# Altium schematic sheet ACCEL.SchDoc
size A3; DocumentNumber: 5; SheetNumber: 5; SheetTotal: 5
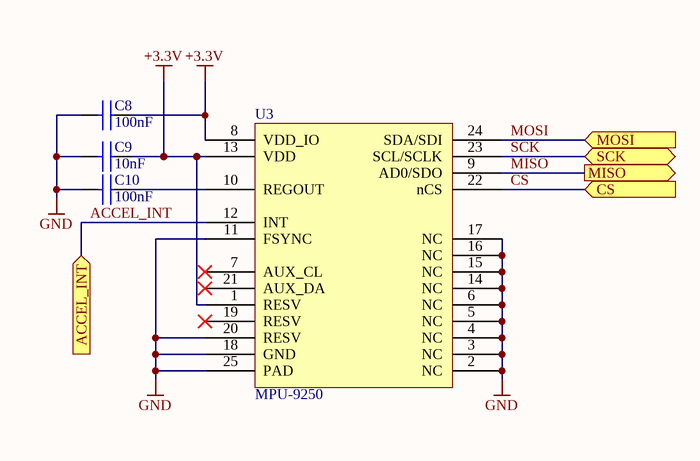
[diagram p0: ACCEL.SchDoc]

## Parts
C8  100nF  [CAP0603]
C9  10nF  [CAP0603]
C10  100nF  [CAP0603]
U3  MPU-9250  [QFN40P300X300X105_HS-25N]

## Ports
ACCEL_INT (in), CS (in), MISO (out), MOSI (in), SCK (bidir)

## Nets
+3.3V: C8.1 C9.1 U3.1(RESV) U3.8(VDD_IO) U3.13(VDD)
GND: C8.2 C9.2 C10.2 U3.2(NC) U3.3(NC) U3.4(NC) U3.5(NC) U3.6(NC) U3.11(FSYNC) U3.14(NC) U3.15(NC) U3.16(NC) U3.17(NC) U3.18(GND) U3.20(RESV) U3.25(PAD)
ACCEL_INT: U3.12(INT) ; port ACCEL_INT
CS: U3.22(nCS) ; port CS
MISO: U3.9(AD0/SDO) ; port MISO
MOSI: U3.24(SDA/SDI) ; port MOSI
SCK: U3.23(SCL/SCLK) ; port SCK
NetC10_1: C10.1 U3.10(REGOUT)

Not connected (* = marked no-connect by the designer): U3 7(AUX_CL)* 19(RESV)* 21(AUX_DA)*

## Notes on the sheet
- Size: A3
- Revision:
- Sheet
- of

## Library data of the parts
C8 C10 = C - 100nF: MURATA - GRM188R71C104KA01J - CAP, MLCC, X7R, 0.1UF, 16V, 0603; IRNAS Part No.: I-200005; Ceramic Capacitor Case: 0603 [1608 Metric]; Capacitance: 0.1; Voltage Rating: 16; Capacitance Tolerance: ± 10%; Dielectric Characteristic: X7; Product Range: GRM Series; SVHC: No SVHC (20-Jun-2016; Supplier 1: Farnell; Manufacturer: MURATA; Manufacturer Part Number: GRM188R71C104KA01J; RoHS: YES; Stock 1: 18297; Pricing 1: 10=0.0145, 100=0.0126, 500=0.0081, 2500=0.0059, 5000=0.0052, 10000=0.0046, 50000=0.0036, 100000=0.0035 (GBP); Packaging: Cut Tape; Operating Temperature Min: -55; Operating Temperature Max: 125; Automotive Qualification Standard: -; MSL: MSL 1 - Unlimited; ComponentLink1URL: http://www.farnell.com/datasheets/2189124.pdf; ComponentLink1Description: http://www.farnell.com/datasheets/2189124.pdf; Supplier Part Number 1: 2688519
C9 = C - 10nF: KEMET - C0603X103K5RECAUTO - CAP, MLCC, AEC-Q200, X7R, 0.01UF, 50V; Manufacturer: TDK EPCOS; IRNAS Part No.: I-200004; Supplier 1: Farnell; Manufacturer Part Number: C0603X103K5RECAUTO; Stock 1: 307350; Pricing 1: 10=0.133, 100=0.0731, 500=0.055, 1000=0.0465, 2000=0.0408, 4000=0.0336, 20000=0.0295 (GBP); ComponentLink1URL: http://www.farnell.com/datasheets/2290180.pdf; ComponentLink1Description: http://www.farnell.com/datasheets/2290180.pdf; Supplier Part Number 1: 2760492
U3 = SEN - MPU-9250: IMU ACCEL/GYRO/MAG I2C/SPI 24QFN; Manufacturer: TDK InvenSense; Interface: I2C; Sensor Type: Accelerometer; Max Supply Voltage: 3.6V; Min Supply Voltage: 2.4V; Output Type: SPI; Manufacturer Part Number: MPU-9250; Stock 1: 0; RoHS: Yes; Mount: Surface Mount; Case/Package: QFN; Number of Pins: 24; Min Operating Temperature: -40°C; Max Operating Temperature: 85°C; Package Quantity: 1; Length: 3.1mm; Height: 1mm; Width: 3.1mm; ComponentLink1URL: https://datasheet.ciiva.com/29175/mpu-9250-29175105.pdf?src-supplier=Digi-Key; ComponentLink1Description: https://datasheet.ciiva.com/29175/mpu-9250-29175105.pdf?src-supplier=Digi-Key; Supplier 1: RSComponents; Supplier Part Number 1: 883-7942P; Supplier 2: Mouser; Supplier Part Number 2: 410-MPU-9250